# Altium schematic sheet Power management + OLED.SchDoc: Sheetname
size A4; Organization: Thomas More: Embedded IT; Address1: Robbe Van Assche; Address2: Belgium; Address3: 2015; Address4: Proof Of Concept: An Analog Datalogger; DocumentNumber: ALT0061; Revision: A; SheetNumber: 3; SheetTotal: 4; PageSetup: Record=PageOptions|CenterHorizontal=True|CenterVertical=True|PrintScale=1.00|XCorrection=1.00|YCorrection=1.00|PrintKind=1|BorderSize=5000000|LeftOffset=0|BottomOffset=0|Orientation=2|PaperLength=1000|PaperWidth=1000|Scale=100|PaperSource=7|PrintQuality=-3|MediaType=1|DitherType=10|PrintScaleMode=1|PaperKind=A4|PaperIndex=9
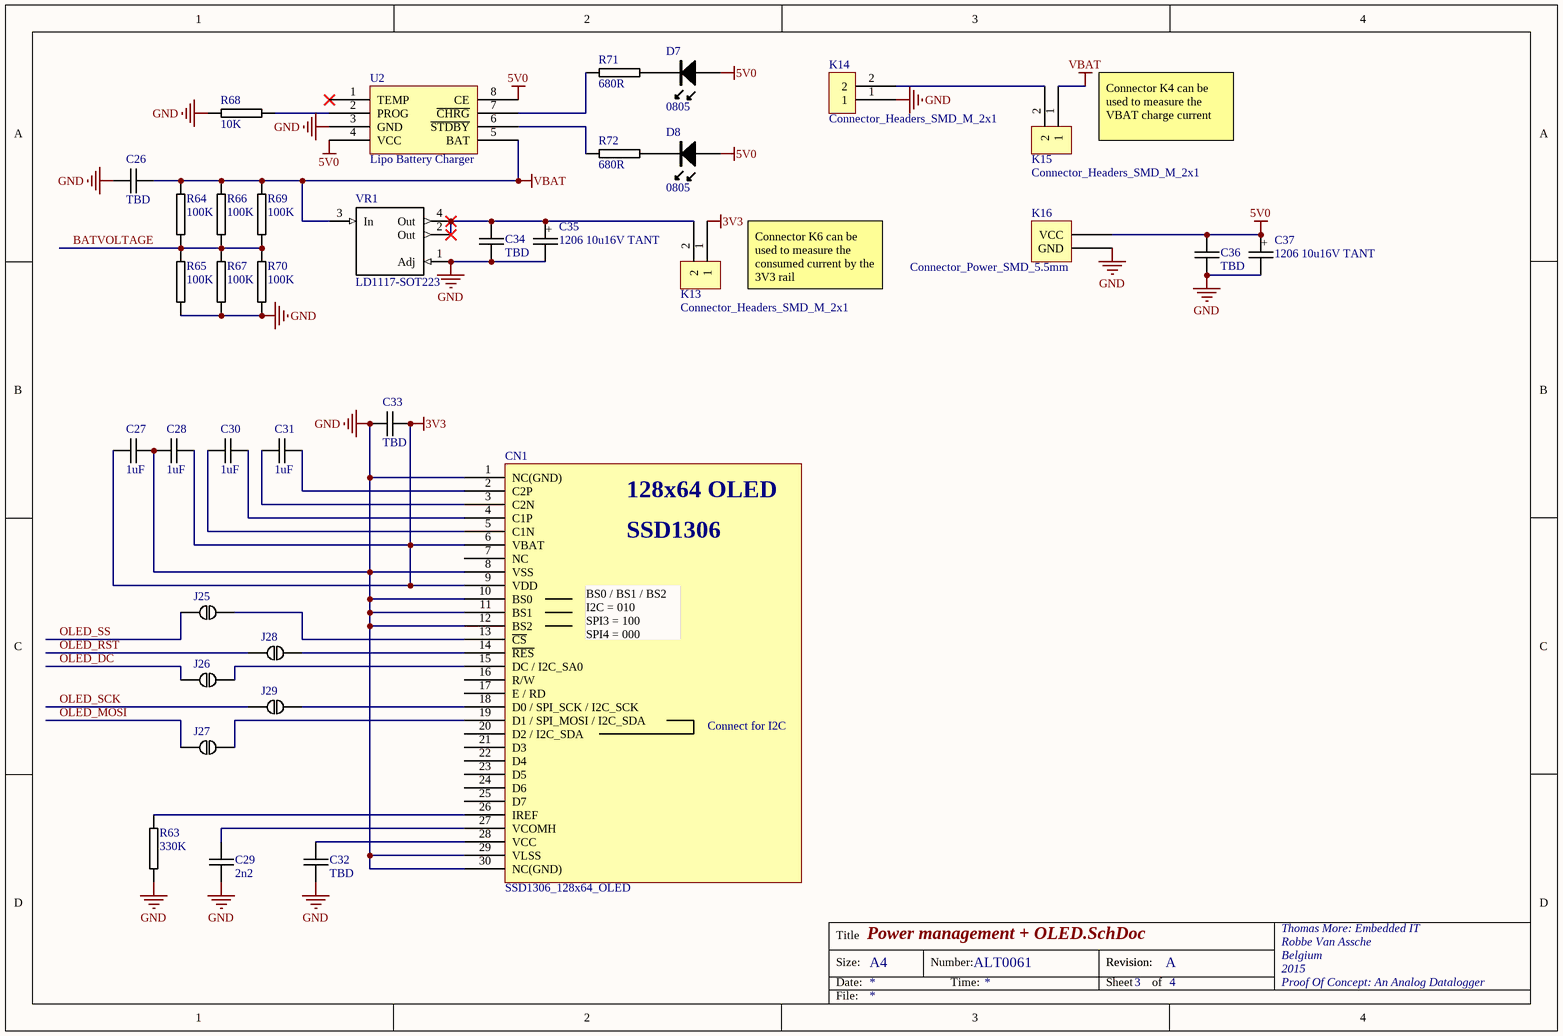
[diagram p0: Power management + OLED.SchDoc]

## Parts
C26  TBD  [1210C-GENERIC]
C27  1uF  [0603C-GENERIC]
C28  1uF  [0603C-GENERIC]
C29  2n2  [0603C-GENERIC]
C30  1uF  [0603C-GENERIC]
C31  1uF  [0603C-GENERIC]
C32  TBD  [1210C-GENERIC]
C33  TBD  [1210C-GENERIC]
C34  TBD  [1210C-GENERIC]
C35  1206 10u16V TANT  [1206C+_TANTAL-10u16V]
C36  TBD  [1210C-GENERIC]
C37  1206 10u16V TANT  [1206C+_TANTAL-10u16V]
CN1  SSD1306_128x64_OLED  [SSD1306_128x64_OLED]
D7  0805  [0805LED]
D8  0805  [0805LED]
J25  Connector_Production Connectors_SMD_BYPASS  [BYPASS]  (value not drawn)
J26  Connector_Production Connectors_SMD_BYPASS  [BYPASS]  (value not drawn)
J27  Connector_Production Connectors_SMD_BYPASS  [BYPASS]  (value not drawn)
J28  Connector_Production Connectors_SMD_BYPASS  [BYPASS]  (value not drawn)
J29  Connector_Production Connectors_SMD_BYPASS  [BYPASS]  (value not drawn)
K13  Connector_Headers_SMD_M_2x1  [Header_Male_2.54 2x1]
K14  Connector_Headers_SMD_M_2x1  [Header_Male_2.54 2x1]
K15  Connector_Headers_SMD_M_2x1  [Header_Male_2.54 2x1]
K16  Connector_Power_SMD_5.5mm  [ADC-028]
R63  330K  [0805R-330K]
R64  100K  [0805R-100K]
R65  100K  [0805R-100K]
R66  100K  [0805R-100K]
R67  100K  [0805R-100K]
R68  10K  [0805R-10K]
R69  100K  [0805R-100K]
R70  100K  [0805R-100K]
R71  680R  [0805R-680]
R72  680R  [0805R-680]
U2  Lipo Battery Charger  [SO8_N]
VR1  LD1117-SOT223  [SOT223]

## Nets
3V3: C27.1 C28.2 C33.2 CN1.6(VBAT) CN1.9(VDD) K13.1
5V0: C36.1 C37.1 D7.A D8.A K16.VCC U2.4(VCC) U2.8(CE)
GND: C26.1 C27.2 C28.1 C29.2 C32.1 C33.1 C34.2 C35.2 C36.2 C37.2 CN1.1(NC(GND)) CN1.8(VSS) CN1.10(BS0) CN1.11(BS1) CN1.12(BS2) CN1.29(VLSS) CN1.30(NC(GND)) K14.1 K16.GND R63.1 R65.2 R67.2 R68.1 R70.2 U2.3(GND) VR1.1(Adj)
VBAT: C26.2 K15.1 R64.1 R66.1 R69.1 U2.5(BAT) VR1.3(In)
BATVOLTAGE: R64.2 R65.1 R66.2 R67.1 R69.2 R70.1
OLED_DC: J26.1
OLED_MOSI: J27.1
OLED_RST: J28.1
OLED_SCK: J29.1
OLED_SS: J25.1
NetC29_1: C29.1 CN1.27(VCOMH)
NetC30_1: C30.1 CN1.5(C1N)
NetC30_2: C30.2 CN1.4(C1P)
NetC31_1: C31.1 CN1.3(C2N)
NetC31_2: C31.2 CN1.2(C2P)
NetC32_2: C32.2 CN1.28(VCC)
NetC34_1: C34.1 C35.1 K13.2 VR1.2(Out) VR1.4(Out)
NetCN1_13: CN1.13(~{CS}) J25.2
NetCN1_14: CN1.14(~{RES}) J28.2
NetCN1_15: CN1.15(DC_/_I2C_SA0) J26.2
NetCN1_18: CN1.18(D0_/_SPI_SCK_/_I2C_SCK) J29.2
NetCN1_19: CN1.19(D1_/_SPI_MOSI_/_I2C_SDA) J27.2
NetCN1_26: CN1.26(IREF) R63.2
NetD7_K: D7.K R71.2
NetD8_K: D8.K R72.2
NetK14_2: K14.2 K15.2
NetR68_2: R68.2 U2.2(PROG)
NetR71_1: R71.1 U2.7(~{CHRG})
NetR72_1: R72.1 U2.6(~{STDBY})

Not connected (* = marked no-connect by the designer): CN1 7(NC) 16(R/W) 17(E_/_RD) 20(D2_/_I2C_SDA) 21(D3) 22(D4) 23(D5) 24(D6) 25(D7); U2 1(TEMP)*

## Notes on the sheet
- (near K15) Connector K4 can be used to measure the VBAT charge current
- (near K13) Connector K6 can be used to measure the consumed current by the 3V3 rail
- Title
- Size:
- Date:
- A4
- Number:
- Time:
- Revision:
- Sheet
- of
- File:
- (in symbol Passives_Capacitors_Tantalum_1206C-TANTAL SIZE A-10u16V) +
- (in symbol SSD1306_128x64_OLED) 128x64 OLED; SSD1306; BS0 / BS1 / BS2 / I2C = 010 / SPI3 = 100 / SPI4 = 000; Connect for I2C

## Library data of the parts
C26 C32-C34 C36 = Passives_Capacitors_1210_1210C-TBD: CAPACITOR 1210 CERAMIC VALUE TO BE DETERMINED
C27 C28 C30 C31 = Passives_Capacitors_0603_1UF-35V-X5R-TAY: CAPACITOR 0603 CERAMIC; Manufacturer Part Number: GMK107BJ105KA-T; Manufacturer: Taiyo Yuden; Reel: C92; Supplier 1: Digi-Key; Supplier Part Number 1: 587-1437-2-ND
C29 = Passives_Capacitors_0603_2N2-50V-C0G-MUR: CAPACITOR 0603 CERAMIC; Reel: C4
C35 C37 = Passives_Capacitors_Tantalum_1206C-TANTAL SIZE A-10u16V
CN1 = SSD1306_128x64_OLED: SSD1306 OLED 128x64
D7 D8 = LED_SMD_0805
J25-J29 = Connector_Production Connectors_SMD_BYPASS: SOLDERDOT BYPASS; Manufacturer Part Number 1: Board Feature; Reel: Open; Supplier 1: Solder-it-yourself; Manufacturer 1: Board feature
K13-K15 = Connector_Headers_SMD_M_2x1: SMD Header 2x1
K16 = Connector_Power_SMD_5.5mm: 5.5mm SMD
R63 = 0805R-330K: RESISTOR 0805 1/4 WATT THIN FILM; Reel: *
R64-R67 R69 R70 = 0805R-100K: RESISTOR 0805 1/4 WATT THIN FILM; Reel: *; Supplier 1: Digi-Key; Supplier Part Number 1: RMCF0805FT100KTR-ND
R68 = 0805R-10K: RESISTOR 0805 1/4 WATT THIN FILM; Reel: *
R71 R72 = 0805R-680: RESISTOR 0805 1/4 WATT THIN FILM; Reel: *
U2 = Battery_SMD_TP4056